# EAGLE design pi.i2c.booster (EAGLE 6.5.0)
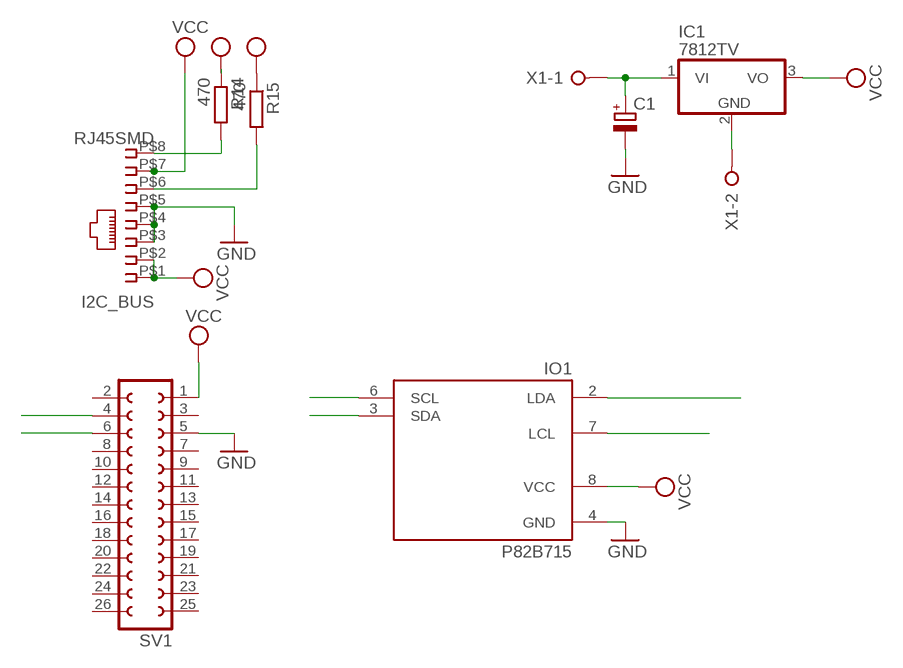
[diagram p0: schematic, sheet 1]

## Parts
C1  CPOL-EUB45181B  [B45181B]
I2C_BUS  RJ45SMD  [RJ45SMD]
IC1  7812TV  [TO220V]
IO1  P82B715  [P82B715SMD]
R14  470  R-EU_R1206  [R1206]
R15  470  R-EU_R1206  [R1206]
SV1  FE13-2  [FE13-2]
X1  W237-02P  [W237-132]

## Nets
+12V: C1.+ I2C_BUS.P$1 I2C_BUS.P$2 IC1.1(VI) X1.1 ; supply symbol labelled VCC
GND: C1.- I2C_BUS.P$3 I2C_BUS.P$4 I2C_BUS.P$5 IC1.2(GND) IO1.4(GND) SV1.5 X1.2
LX: I2C_BUS.P$8 IO1.2(LDA) R14.2
LY: I2C_BUS.P$6 IO1.7(LCL) R15.2
SCL: IO1.6(SCL) SV1.6
SDA: IO1.3(SDA) SV1.4
VCC: I2C_BUS.P$7 IC1.3(VO) IO1.8(VCC) R14.1 R15.1 SV1.1
Unconnected: SV1.2 SV1.3 SV1.7 SV1.8 SV1.9 SV1.10 SV1.11 SV1.12 SV1.13 SV1.14 SV1.15 SV1.16 SV1.17 SV1.18 SV1.19 SV1.20 SV1.21 SV1.22 SV1.23 SV1.24 SV1.25 SV1.26

## Library data of the parts
C1 = rcl:CPOL-EU: POLARIZED CAPACITOR, European symbol
I2C_BUS = con-tycoelectronics:RJ45SMD
IC1 = linear:78*: Positive VOLTAGE REGULATOR Source: http://cache.national.com/ds/LM/LM78L05.pdf http://www.fairchildsemi.com/ds/LM/LM7805.pdf
IO1 = i2c:P82B715
R14 R15 = rcl:R-EU_: RESISTOR, European symbol
SV1 = con-lsta:FE13-2: FEMALE HEADER; OC_FARNELL: unknown; OC_NEWARK: unknown
X1 = con-wago-508:W237-02P: WAGO SREW CLAMP; OC_FARNELL: unknown; OC_NEWARK: unknown

## Board
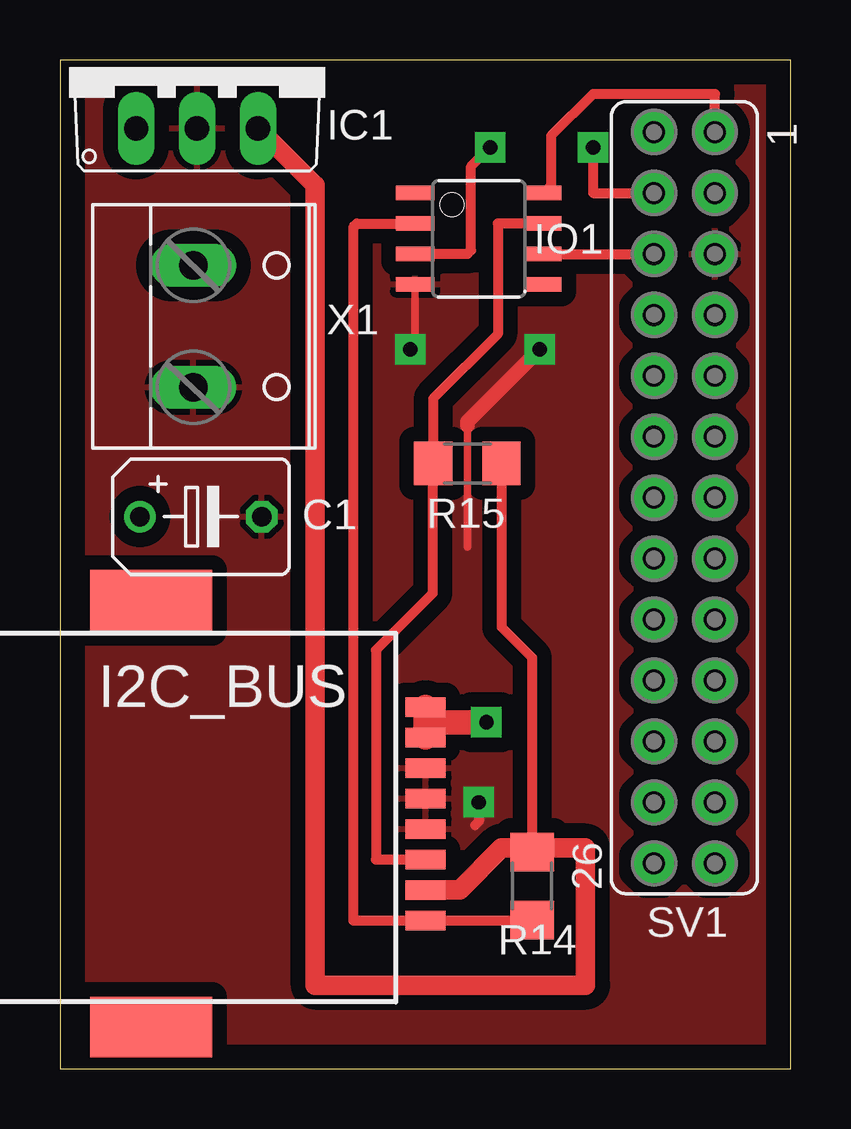
[diagram p1: board, top side]
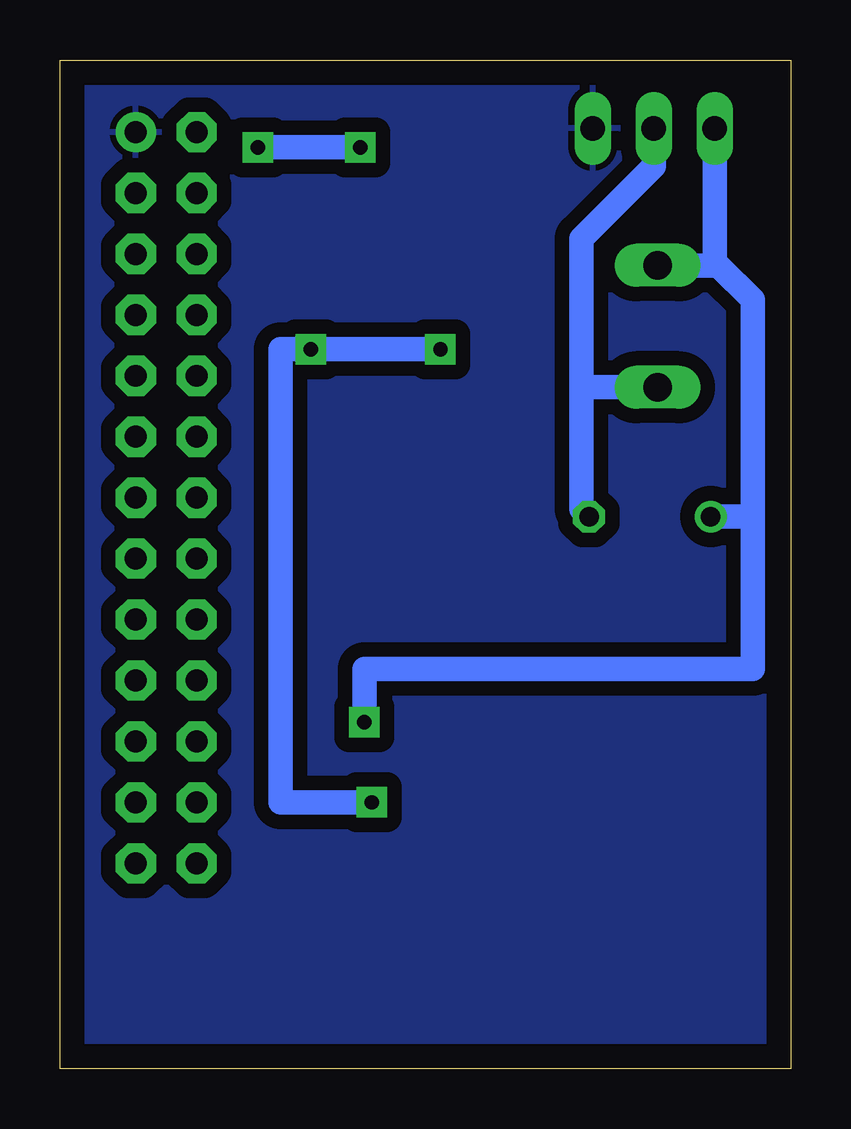
[diagram p2: board, bottom side, seen from below]

Size 30.47 x 42.06 mm. Coordinates in mm from the lower left corner, seen from the top.
Outline: 0,0 30.47,0 30.47,42.06 0,42.06 0,0
Copper layers (1*16): Top 0.035mm / dielectric 1.5mm / Bottom 0.035mm
Design rules "default": minimum track width 10mil, minimum drill 24mil, track to track 8mil, track to pad 8mil, pad to pad 8mil, via to via 8mil, smd to smd 8mil, copper to edge 40mil, drill to drill 8mil, minimum pad ring 10mil, minimum via ring 8mil, stop-mask expansion 4mil, vias tented up to drill 0mil, thermal gap 10mil

### Footprints (pad centres in the part's own frame; a part is rotated, then mirrored left to right if it is on the bottom)
B45181B = drill 0.813: + -2.54,0 | drill 0.813 octagon: - 2.54,0
RJ45SMD = smd 0.813 x 1.676: P$1 -4.445,8.255; P$2 -3.175,8.255; P$3 -1.905,8.255; P$4 -0.635,8.255; P$5 0.635,8.255; P$6 1.905,8.255; P$7 3.175,8.255; P$8 4.445,8.255 | smd 2.54 x 5.08: P$9 8.89,-3.175; P$10 -8.89,-3.175
TO220V = drill 1.016 long: 1 -2.54,-2.54; 2 0,-2.54; 3 2.54,-2.54
P82B715SMD = smd 0.6 x 1.6: 1 -1.905,-2.654; 2 -0.645,-2.654; 3 0.625,-2.654; 4 1.895,-2.654; 5 1.905,2.654; 6 0.635,2.654; 7 -0.635,2.654; 8 -1.905,2.654
R1206 = smd 1.6 x 1.803: 1 -1.422,0; 2 1.422,0
FE13-2 = drill 0.914 pad 1.676: 1 -15.24,1.27 | drill 0.914 pad 1.676 octagon: 2 -15.24,-1.27; 3 -12.7,1.27; 4 -12.7,-1.27; 5 -10.16,1.27; 6 -10.16,-1.27; 7 -7.62,1.27; 8 -7.62,-1.27; 9 -5.08,1.27; 10 -5.08,-1.27; 11 -2.54,1.27; 12 -2.54,-1.27; 13 0,1.27; 14 0,-1.27; 15 2.54,1.27; 16 2.54,-1.27; 17 5.08,1.27; 18 5.08,-1.27; 19 7.62,1.27; 20 7.62,-1.27; 21 10.16,1.27; 22 10.16,-1.27; 23 12.7,1.27; 24 12.7,-1.27; 25 15.24,1.27; 26 15.24,-1.27
W237-132 = drill 1.194 long: 1 -2.54,-0.635; 2 2.54,-0.635

### Placement (x,y rotation side)
C1  5.87,23.02 0 top
I2C_BUS  6.99,10.64 270 top
IC1  5.71,41.75 0 top
IO1  17.46,34.61 270 top
R14  19.68,7.62 270 top
R15  16.99,25.24 180 top
SV1  26.04,23.81 270 top
X1  6.19,30.96 270 top

### Tracks (layer width: path | path; a pad name or v marks a point on that pad's centre or on a via)
+12V  (via drill 0.6 pad 1.27)
  Top 1.016: I2C_BUS.P$1 15.24,14.45 | I2C_BUS.P$2 15.24,14.45 | 15.24,14.45 v17.78,14.45
  Bottom 0.61: 1.91,23.02 1.59,23.34
  Bottom 1.016: v17.78,14.45 17.78,16.67 1.59,16.67 1.59,23.34 1.59,32.07 3.02,33.5 | C1.+ 1.91,23.02 | 3.02,33.5 X1.1 | IC1.1 3.17,33.65 3.02,33.5
GND  (via drill 0.6 pad 1.27)
  Top 0.305: 16.99,26.83 16.99,21.75 | IO1.4 14.81,30.21 v14.61,30
  Top 0.406: v17.46,11.11 17.46,10.32 17.3,10.16
  Top 0.61: 16.99,26.83 16.99,26.99 v20,30
  Bottom 1.016: v14.61,30 v20,30 21.27,30 21.27,11.11 v17.46,11.11 | IC1.2 5.71,37.62 8.73,34.61 8.73,28.42 | 8.73,28.42 X1.2 | 8.73,28.42 8.73,23.34 C1.-
  pour Top (isolate 0.61): -0.64,42.7 30.96,42.54 30.96,-0.48 -0.64,-0.48
LX
  Top 0.305: 19.52,6.19 R14.2 | IO1.2
  Top 0.406: 19.52,6.19 I2C_BUS.P$8 12.22,6.19 12.22,35.08 12.38,35.24 IO1.2
LY
  Top 0.305: 15.4,25.4 R15.2 15.55,25.23
  Top 0.406: I2C_BUS.P$6 13.18,8.73 13.18,17.46 15.55,19.84 15.55,25.23 | IO1.7 18.26,35.24 18.26,30.64 15.56,27.94 R15.2
SCL
  Top 0.406: IO1.6 SV1.6
SDA  (via drill 0.6 pad 1.27)
  Top 0.305: 17,33.98 17.14,34.13
  Top 0.406: IO1.3 17,33.98 | 17.14,34.13 17.14,37.62 v17.94,38.42 | v22.22,38.42 22.22,36.51 SV1.4
  Bottom 1.016: v17.94,38.42 v22.22,38.42
VCC
  Top 0.305: 20.48,36.87 IO1.8
  Top 0.406: SV1.1 27.3,40.64 22.22,40.64 20.48,38.89 20.48,36.87 | R15.1 18.41,18.42 19.68,17.14 R14.1
  Top 0.813: I2C_BUS.P$7 16.67,7.46 18.41,9.21 19.53,9.21 R14.1 19.68,9.21 21.91,9.21 21.91,3.49 10.64,3.49 10.64,36.83 IC1.3
  pour Bottom (isolate 0.61): 0,43.02 30.32,43.02 30.32,-1.43 0,-1.59